# Altium schematic sheet Structure.SchDoc: Structure
size A3; SheetTotal: 1
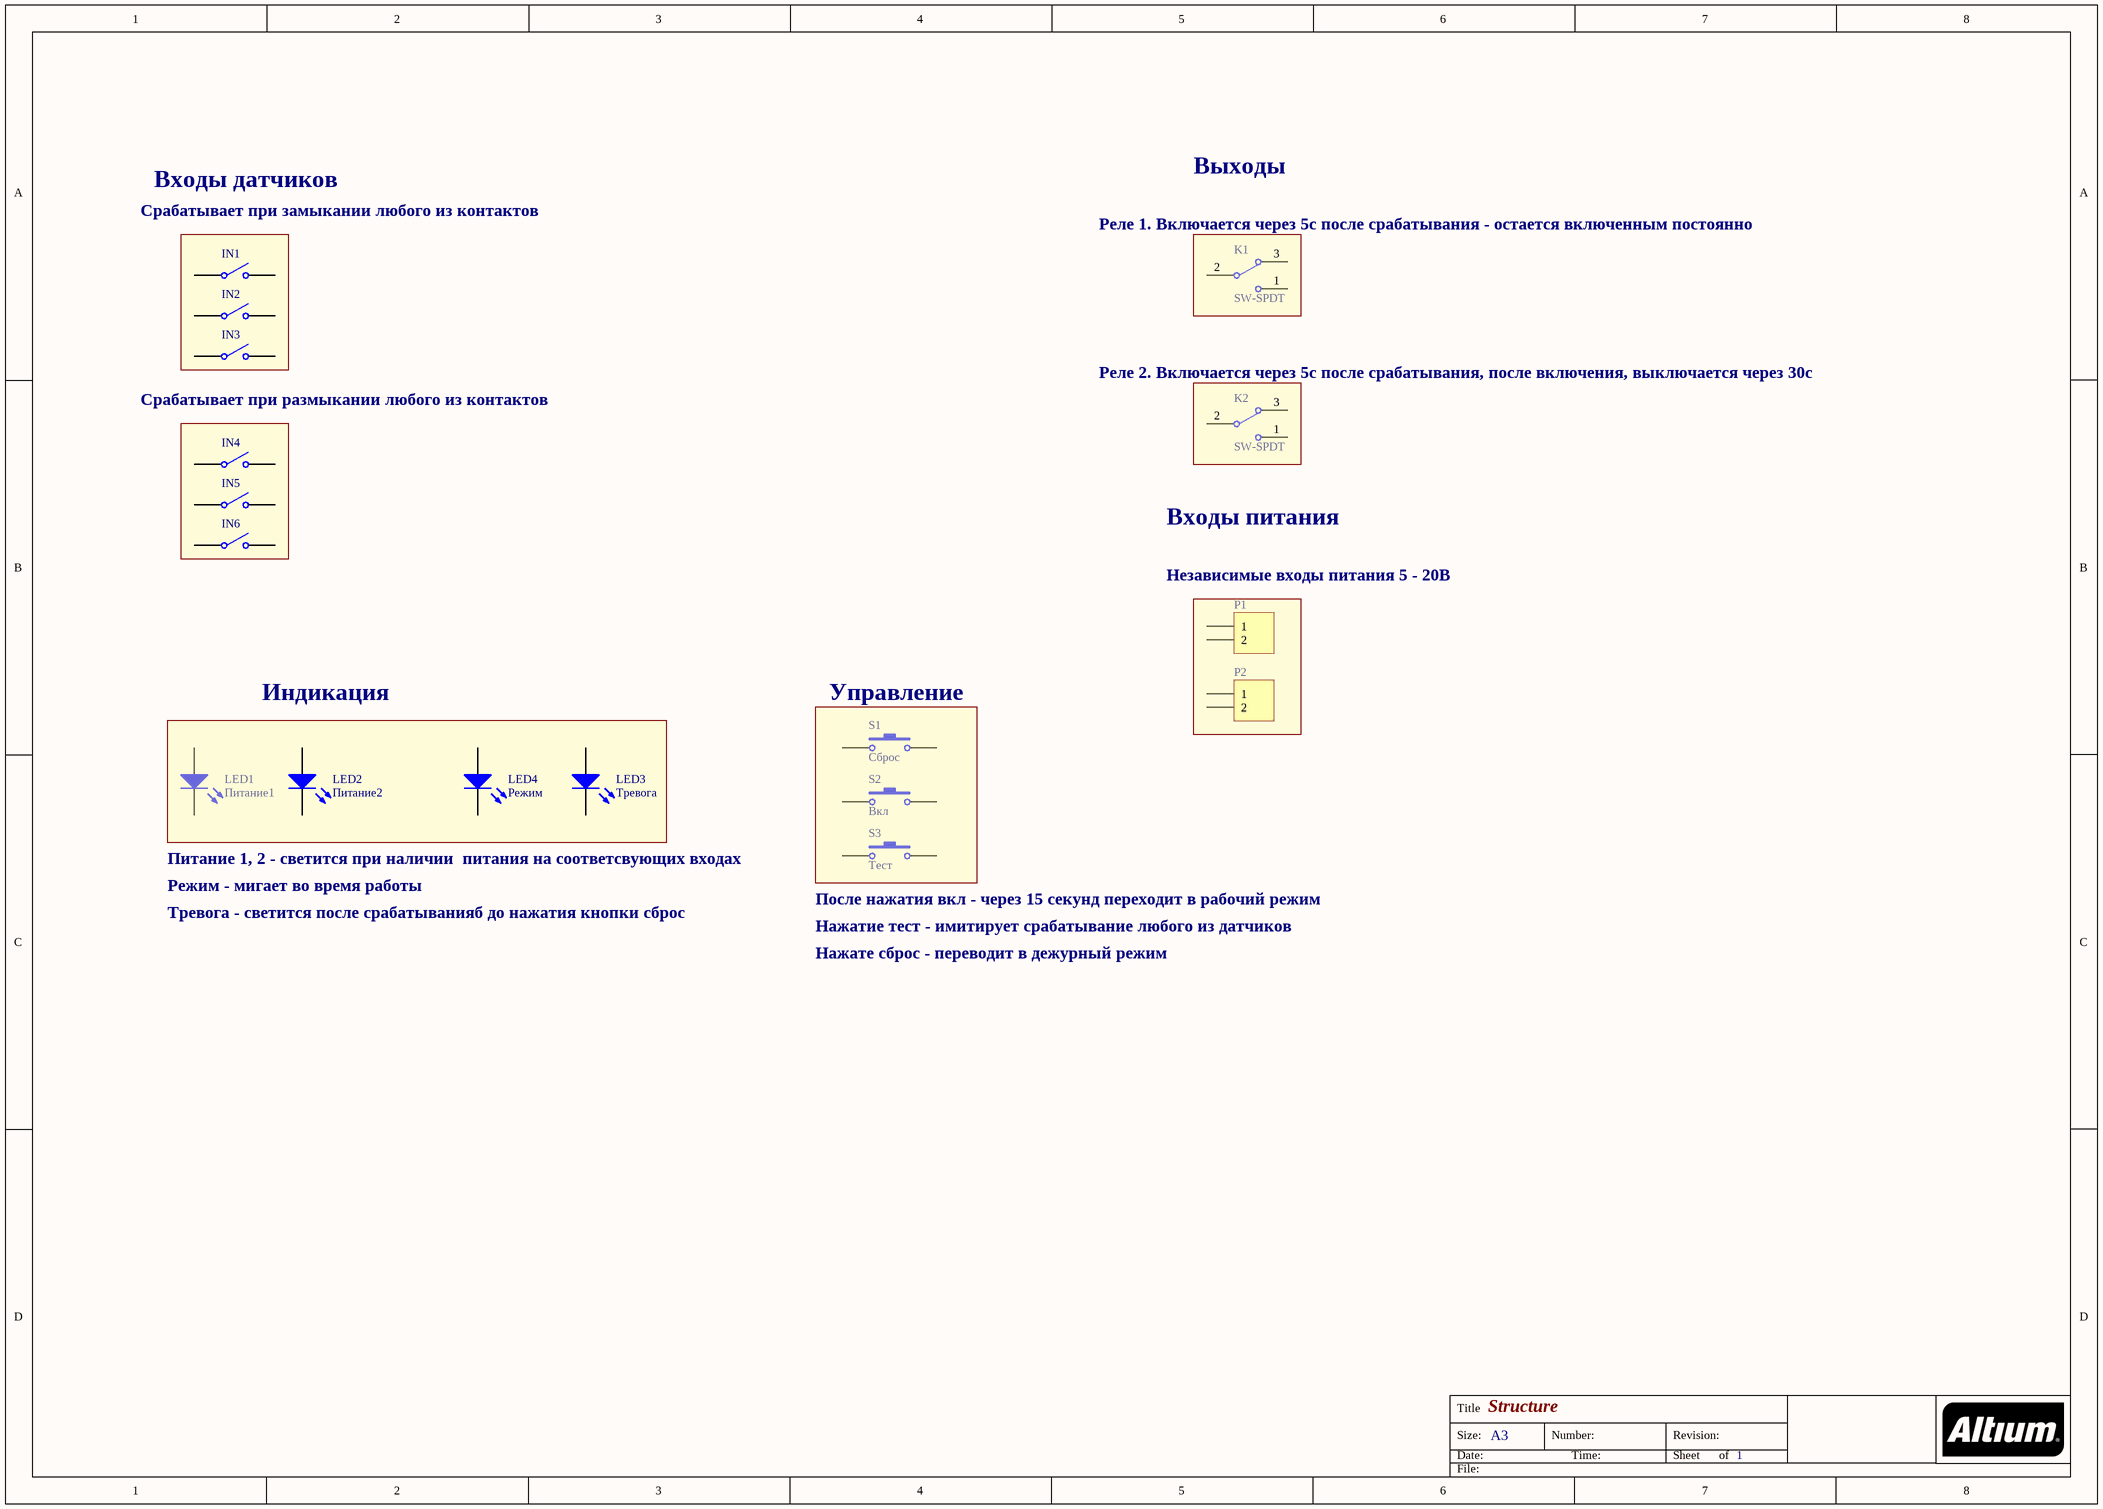
[diagram p0: Structure.SchDoc]

## Parts
IN1  SW-SPST  [SPST-2]  (value not drawn)
IN2  SW-SPST  [SPST-2]  (value not drawn)
IN3  SW-SPST  [SPST-2]  (value not drawn)
IN4  SW-SPST  [SPST-2]  (value not drawn)
IN5  SW-SPST  [SPST-2]  (value not drawn)
IN6  SW-SPST  [SPST-2]  (value not drawn)
K1  SW-SPDT  [TL36WW15050]
K2  SW-SPDT  [TL36WW15050]
LED1  Питание1  [LED_3MM_RED_1C-2A]
LED2  Питание2  [LED_3MM_RED_1C-2A]
LED3  Тревога  [LED_3MM_RED_1C-2A]
LED4  Режим  [LED_3MM_RED_1C-2A]
P1  24V_In  [PHOENIX_1715721]  (value not drawn)
P2  24V_In  [PHOENIX_1715721]  (value not drawn)
S1  Сброс  [PB_OMRON_B3F-1070]
S2  Вкл  [PB_OMRON_B3F-1070]
S3  Тест  [PB_OMRON_B3F-1070]

## Blocks framed on the sheet
Управление: S1-S3
Индикация: LED1-LED4

## Nets

Not connected (* = marked no-connect by the designer): IN1 1(COMMON) 2(NO); IN2 1(COMMON) 2(NO); IN3 1(COMMON) 2(NO); IN4 1(COMMON) 2(NO); IN5 1(COMMON) 2(NO); IN6 1(COMMON) 2(NO); K1 1 2 3; K2 1 2 3; LED1 1(A) 2(K); LED2 1(A) 2(K); LED3 1(A) 2(K); LED4 1(A) 2(K); P1 1 2; P2 1 2; S1 1 2; S2 1 2; S3 1 2

## Notes on the sheet
- Выходы
- Срабатывает при замыкании любого из контактов
- Входы датчиков
- (near K1) Реле 1. Включается через 5с после срабатывания - остается включенным постоянно
- (near K2) Реле 2. Включается через 5с после срабатывания, после включения, выключается через 30с
- Срабатывает при размыкании любого из контактов
- Входы питания
- (near P1) Независимые входы питания 5 - 20В
- Питание 1, 2 - светится при наличии  питания на соответсвующих входах
- Режим - мигает во время работы
- Тревога - светится после срабатыванияб до нажатия кнопки сброс
- (near S3) После нажатия вкл - через 15 секунд переходит в рабочий режим
- Нажатие тест - имитирует срабатывание любого из датчиков
- Нажате сброс - переводит в дежурный режим
- Title
- Size:
- Date:
- A3
- Number:
- Time:
- Revision:
- Sheet
- of
- File:

## Library data of the parts
IN1-IN6 = SW-SPST: Single-Pole, Single-Throw Switch; Published: 24-Mar-1999; LatestRevisionDate: 17-Jul-2002; LatestRevisionNote: Re-released for DXP Platform.; PackageReference: SPST-2; Publisher: Altium Limited; PackageDescription: Switch; 2 Leads
K1 K2 = SW-SPDT: SPDT Subminiature Toggle Switch, Right Angle Mounting, Vertical Actuation; Published: 24-Mar-1999; LatestRevisionDate: 17-Dec-2003; LatestRevisionNote: Schematic revised, PCB Footprint replaced.; DatasheetVersion: 05-Dec-2000; PackageReference: TL36WW15050; Publisher: Altium Limited; PackageDescription: Switch; 4 Leads; ComponentLink1Description: Manufacturer Link; ComponentLink1URL: http://www.apem.com
LED1-LED4 = LED0: Typical INFRARED GaAs LED; Published: 8-Jun-2000; LatestRevisionDate: 08-Jul-2005; LatestRevisionNote: Mech Layer 1 removed.; PackageReference: LED-0; Publisher: Altium Limited; PackageDescription: LED; 2 Leads
P1 P2 = Header 2: Header, 2-Pin; LatestRevisionDate: 17-Jul-2002; LatestRevisionNote: Re-released for DXP Platform.; Publisher: Altium Limited
S1-S3 = SW-PB: Switch; Published: 24-Mar-1999; LatestRevisionDate: 17-Jul-2002; LatestRevisionNote: Re-released for DXP Platform.; PackageReference: SPST-2; Publisher: Altium Limited; PackageDescription: Switch; 2 Leads